# Altium schematic sheet Voltage_Supply.SchDoc
size A4; SheetNumber: 2; SheetTotal: 13
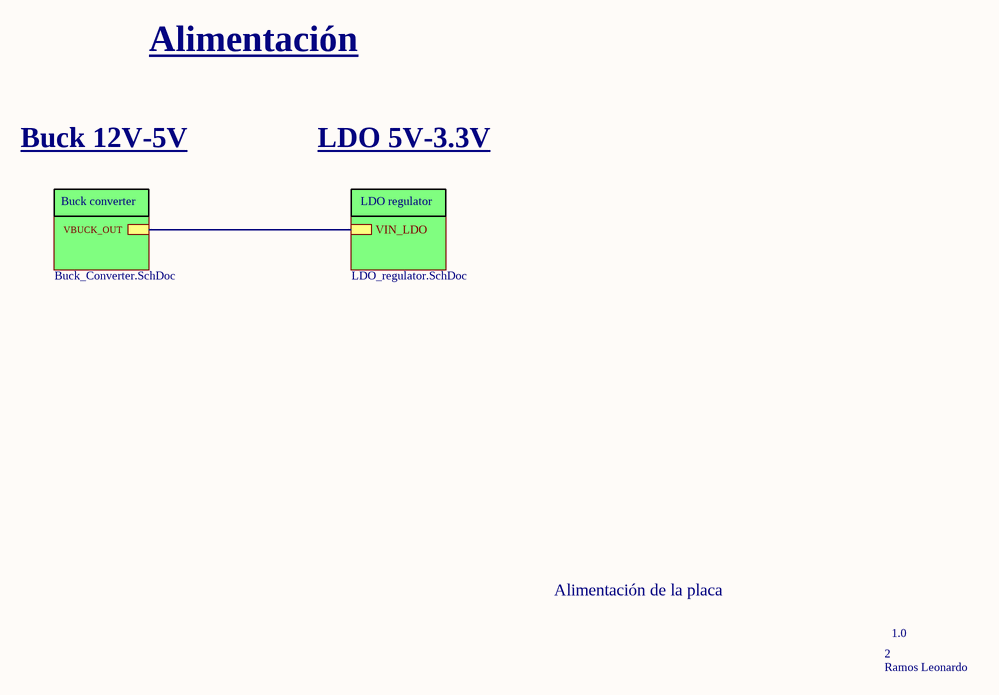
[diagram p0: Voltage_Supply.SchDoc]

## Sub-sheets
Buck_Converter = Buck_Converter.SchDoc: VBUCK_OUT
LDO_1 = LDO_regulator.SchDoc: VIN_LDO

## Nets
(unnamed): sheet Buck_Converter/VBUCK_OUT, sheet LDO_1/VIN_LDO

## Notes on the sheet
- Alimentación
- Buck 12V-5V
- LDO 5V-3.3V
- Buck converter
- LDO regulator
- Alimentación de la placa
- 2
- 1.0
- Ramos Leonardo